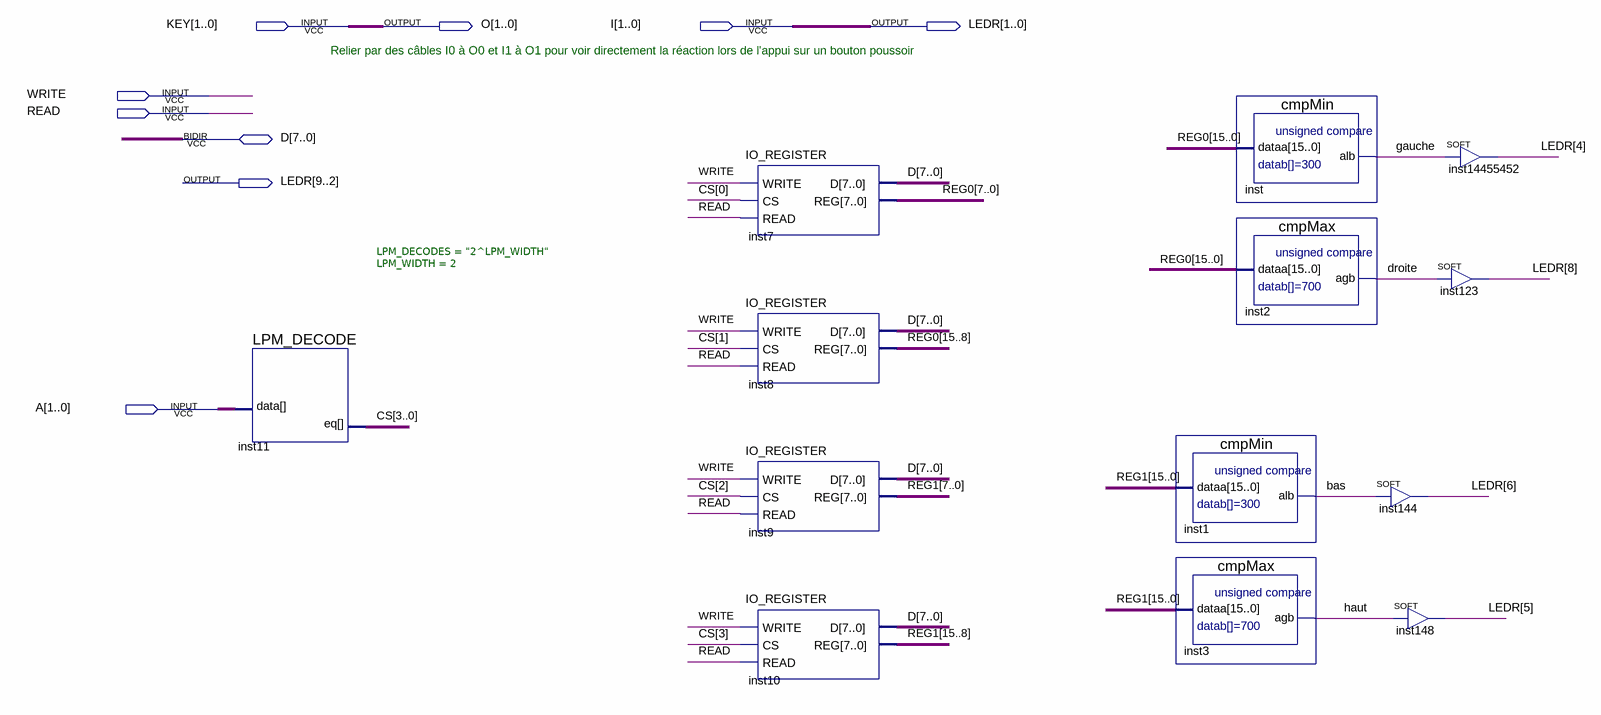
[diagram p0: schematic sheet]
// Quartus schematic mainjoystick.bdf as structural Verilog: 13 symbols, 9 pins
module mainjoystick (
  input  [1:0] KEY,
  input  [1:0] I,
  input  WRITE,
  input  READ,
  input  [1:0] A,
  inout  [7:0] D,
  output [1:0] O,
  output [9:0] LEDR
);

  wire bas, droite, gauche, haut;
  wire [3:0] CS;
  wire [15:0] REG0, REG1;

  LPM_DECODE #(.LPM_DECODES("2^LPM_WIDTH"), .LPM_WIDTH(2)) inst11 (.data(A), .eq(CS));
  IO_REGISTER inst7 (.WRITE(WRITE), .CS(CS[0]), .READ(READ), .REG(REG0[7:0]), .D(D));
  IO_REGISTER inst8 (.WRITE(WRITE), .CS(CS[1]), .READ(READ), .REG(REG0[15:8]), .D(D));
  IO_REGISTER inst9 (.WRITE(WRITE), .CS(CS[2]), .READ(READ), .REG(REG1[7:0]), .D(D));
  IO_REGISTER inst10 (.WRITE(WRITE), .CS(CS[3]), .READ(READ), .REG(REG1[15:8]), .D(D));
  cmpMin inst1 (.dataa(REG1), .alb(bas));
  cmpMax inst3 (.dataa(REG1), .agb(haut));
  cmpMin inst (.dataa(REG0), .alb(gauche));
  cmpMax inst2 (.dataa(REG0), .agb(droite));
  SOFT inst144 (.IN(bas), .OUT(LEDR[6]));
  SOFT inst148 (.IN(haut), .OUT(LEDR[5]));
  SOFT inst14455452 (.IN(gauche), .OUT(LEDR[4]));
  SOFT inst123 (.IN(droite), .OUT(LEDR[8]));

  assign LEDR[1:0] = I;
  assign O = KEY;

  // Notes on the sheet:
  //   Relier par des câbles I0 à O0 et I1 à O1 pour voir directement la réaction lors de l'appui sur un bouton poussoir
endmodule
